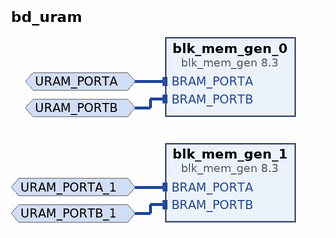
[diagram p0: block diagram of the top level]
# Vivado block design bd_uram, xcvu9p-flgb2104-2-i, Vivado 2017.1_sdxop
create_bd_design bd_uram

create_bd_intf_port -mode Slave -vlnv xilinx.com:interface:bram_rtl:1.0 URAM_PORTA
create_bd_intf_port -mode Slave -vlnv xilinx.com:interface:bram_rtl:1.0 URAM_PORTB
create_bd_intf_port -mode Slave -vlnv xilinx.com:interface:bram_rtl:1.0 URAM_PORTA_1
create_bd_intf_port -mode Slave -vlnv xilinx.com:interface:bram_rtl:1.0 URAM_PORTB_1

create_bd_cell -type ip -vlnv xilinx.com:ip:blk_mem_gen:8.3 blk_mem_gen_0
set_property -dict [list \
  CONFIG.Memory_Type Simple_Dual_Port_RAM \
  CONFIG.PRIM_type_to_Implement URAM \
  CONFIG.Enable_32bit_Address false \
  CONFIG.Use_Byte_Write_Enable false \
  CONFIG.Write_Depth_A 819200 \
  CONFIG.Operating_Mode_A READ_FIRST \
  CONFIG.Register_PortB_Output_of_Memory_Primitives false \
  CONFIG.Port_B_Clock 100 \
  CONFIG.Port_B_Enable_Rate 100 \
  CONFIG.use_bram_block Stand_Alone \
] [get_bd_cells blk_mem_gen_0]
create_bd_cell -type ip -vlnv xilinx.com:ip:blk_mem_gen:8.3 blk_mem_gen_1
set_property -dict [list \
  CONFIG.Memory_Type Simple_Dual_Port_RAM \
  CONFIG.PRIM_type_to_Implement URAM \
  CONFIG.Enable_32bit_Address false \
  CONFIG.Use_Byte_Write_Enable false \
  CONFIG.Write_Depth_A 819200 \
  CONFIG.Operating_Mode_A READ_FIRST \
  CONFIG.Register_PortB_Output_of_Memory_Primitives false \
  CONFIG.Port_B_Clock 100 \
  CONFIG.Port_B_Enable_Rate 100 \
  CONFIG.use_bram_block Stand_Alone \
] [get_bd_cells blk_mem_gen_1]

# ---- connections ----

connect_bd_intf_net [get_bd_intf_ports URAM_PORTA] [get_bd_intf_pins blk_mem_gen_0/BRAM_PORTA]
connect_bd_intf_net [get_bd_intf_ports URAM_PORTB] [get_bd_intf_pins blk_mem_gen_0/BRAM_PORTB]
connect_bd_intf_net -intf_net BRAM_PORTA_1_1 [get_bd_intf_ports URAM_PORTA_1] [get_bd_intf_pins blk_mem_gen_1/BRAM_PORTA]
connect_bd_intf_net -intf_net BRAM_PORTB_1_1 [get_bd_intf_ports URAM_PORTB_1] [get_bd_intf_pins blk_mem_gen_1/BRAM_PORTB]

validate_bd_design
save_bd_design
